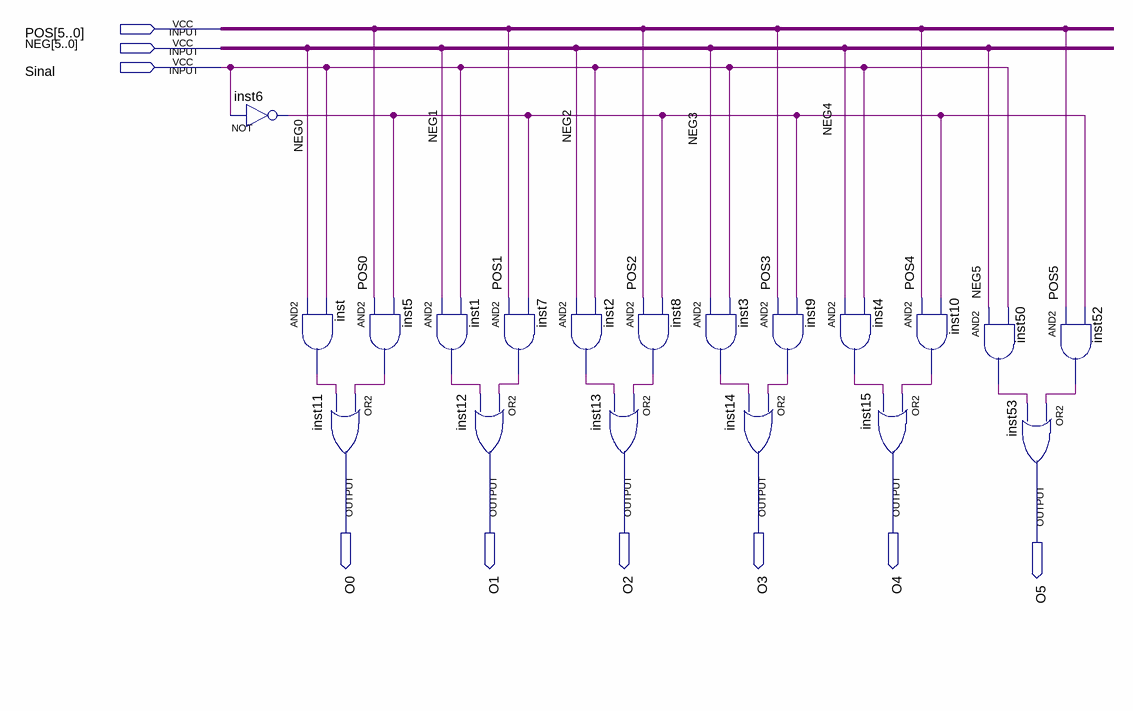
[diagram p0: schematic sheet]
// Quartus schematic MUXDozeSeis.bdf as structural Verilog: 19 symbols, 9 pins
module MUXDozeSeis (
  input  [5:0] POS,
  input  [5:0] NEG,
  input  Sinal,
  output O0,
  output O1,
  output O2,
  output O3,
  output O4,
  output O5
);

  wire inst1_out, inst2_out, inst3_out, inst4_out, inst5_out, inst6_out, inst7_out, inst8_out, inst9_out,
       inst10_out, inst50_out, inst52_out, inst_out;

  not inst6 (inst6_out, Sinal);
  and inst (inst_out, NEG[0], Sinal);
  and inst5 (inst5_out, POS[0], inst6_out);
  or inst11 (O0, inst5_out, inst_out);
  and inst1 (inst1_out, NEG[1], Sinal);
  or inst12 (O1, inst7_out, inst1_out);
  and inst7 (inst7_out, POS[1], inst6_out);
  and inst2 (inst2_out, NEG[2], Sinal);
  or inst13 (O2, inst8_out, inst2_out);
  and inst3 (inst3_out, NEG[3], Sinal);
  and inst8 (inst8_out, POS[2], inst6_out);
  and inst9 (inst9_out, POS[3], inst6_out);
  or inst14 (O3, inst9_out, inst3_out);
  and inst4 (inst4_out, NEG[4], Sinal);
  and inst10 (inst10_out, POS[4], inst6_out);
  or inst15 (O4, inst10_out, inst4_out);
  and inst50 (inst50_out, NEG[5], Sinal);
  and inst52 (inst52_out, POS[5], inst6_out);
  or inst53 (O5, inst52_out, inst50_out);
endmodule
